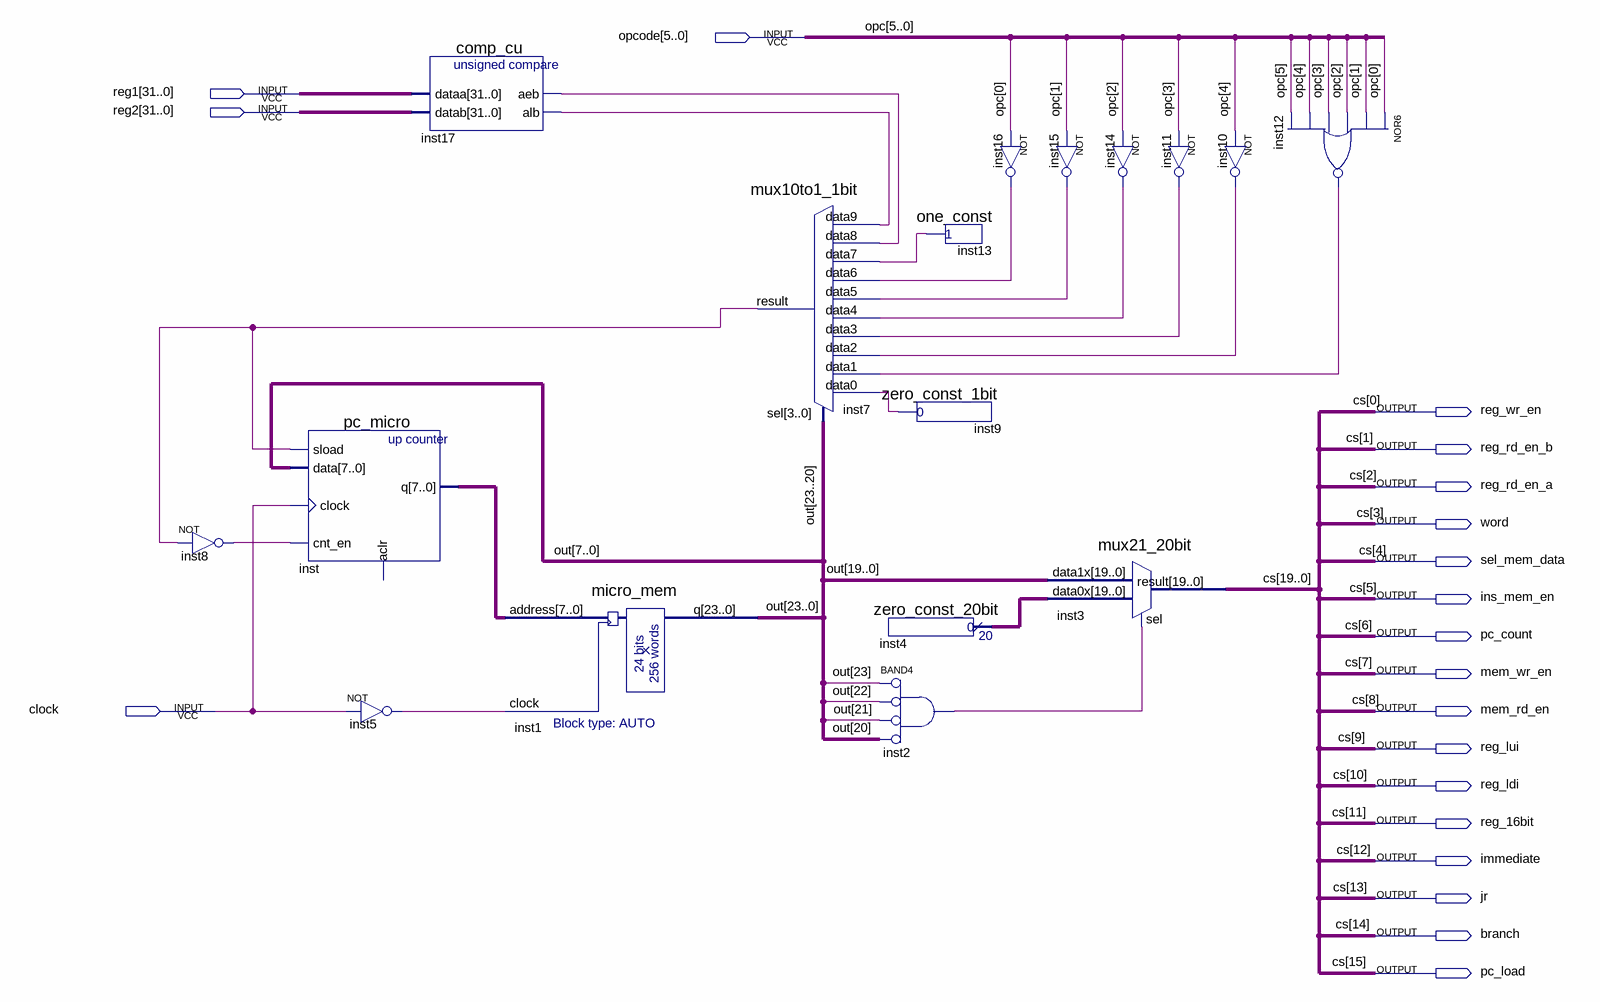
[diagram p0: schematic sheet]
// Quartus schematic CU_mp.bdf as structural Verilog: 17 symbols, 20 pins
module CU_mp (
  input  [5:0] opcode,
  input  [31:0] reg1,
  input  [31:0] reg2,
  input  clock,
  output reg_wr_en,
  output reg_rd_en_b,
  output reg_rd_en_a,
  output word,
  output sel_mem_data,
  output ins_mem_en,
  output pc_count,
  output mem_wr_en,
  output mem_rd_en,
  output reg_lui,
  output reg_ldi,
  output reg_16bit,
  output immediate,
  output jr,
  output branch,
  output pc_load
);

  wire inst2_out, inst5_out, inst7_result, inst8_out, inst9_result, inst10_out, inst11_out, inst12_out,
       inst13_result, inst14_out, inst15_out, inst16_out, inst17_aeb, inst17_alb;
  wire [7:0] inst_q;
  wire [19:0] inst4_result;
  wire [19:16] cs;
  wire [23:0] out;

  not inst8 (inst8_out, inst7_result);
  pc_micro inst (.sload(inst7_result), .data(out[7:0]), .clock(clock), .cnt_en(inst8_out), .q(inst_q));  // open: aclr
  not inst5 (inst5_out, clock);
  comp_cu inst17 (.dataa(reg1), .datab(reg2), .aeb(inst17_aeb), .alb(inst17_alb));
  micro_mem inst1 (.address(inst_q), .clock(inst5_out), .q(out));
  mux10to1_1bit inst7 (
    .data9(inst17_alb), .data8(inst17_aeb), .data7(inst13_result), .data6(inst16_out), .data5(inst15_out),
    .data4(inst14_out), .data3(inst11_out), .data2(inst10_out), .data1(inst12_out), .data0(inst9_result),
    .sel(out[23:20]), .result(inst7_result));
  zero_const_20bit inst4 (.result(inst4_result));
  and inst2 (inst2_out, ~out[23], ~out[22], ~out[21], ~out[20]);  // BAND4
  one_const inst13 (.result(inst13_result));
  zero_const_1bit inst9 (.result(inst9_result));
  not inst16 (inst16_out, opcode[0]);
  not inst14 (inst14_out, opcode[2]);
  not inst15 (inst15_out, opcode[1]);
  mux21_20bit inst3 (
    .data1x(out[19:0]), .data0x(inst4_result), .sel(inst2_out),
    .result({cs, pc_load, branch, jr, immediate, reg_16bit, reg_ldi, reg_lui, mem_rd_en, mem_wr_en, pc_count, ins_mem_en, sel_mem_data, word, reg_rd_en_a, reg_rd_en_b, reg_wr_en}));
  not inst11 (inst11_out, opcode[3]);
  not inst10 (inst10_out, opcode[4]);
  nor inst12 (inst12_out, opcode[0], opcode[1], opcode[2], opcode[3], opcode[4], opcode[5]);

  // Other names for the same wires on the sheet: cs[15:0] = {pc_load, branch, jr, immediate, reg_16bit, reg_ldi, reg_lui, mem_rd_en, mem_wr_en, pc_count, ins_mem_en, sel_mem_data, word, reg_rd_en_a, reg_rd_en_b, reg_wr_en};
  //   opc[5:0] = opcode
endmodule
